# Altium schematic sheet Sheet1.SchDoc
size A3
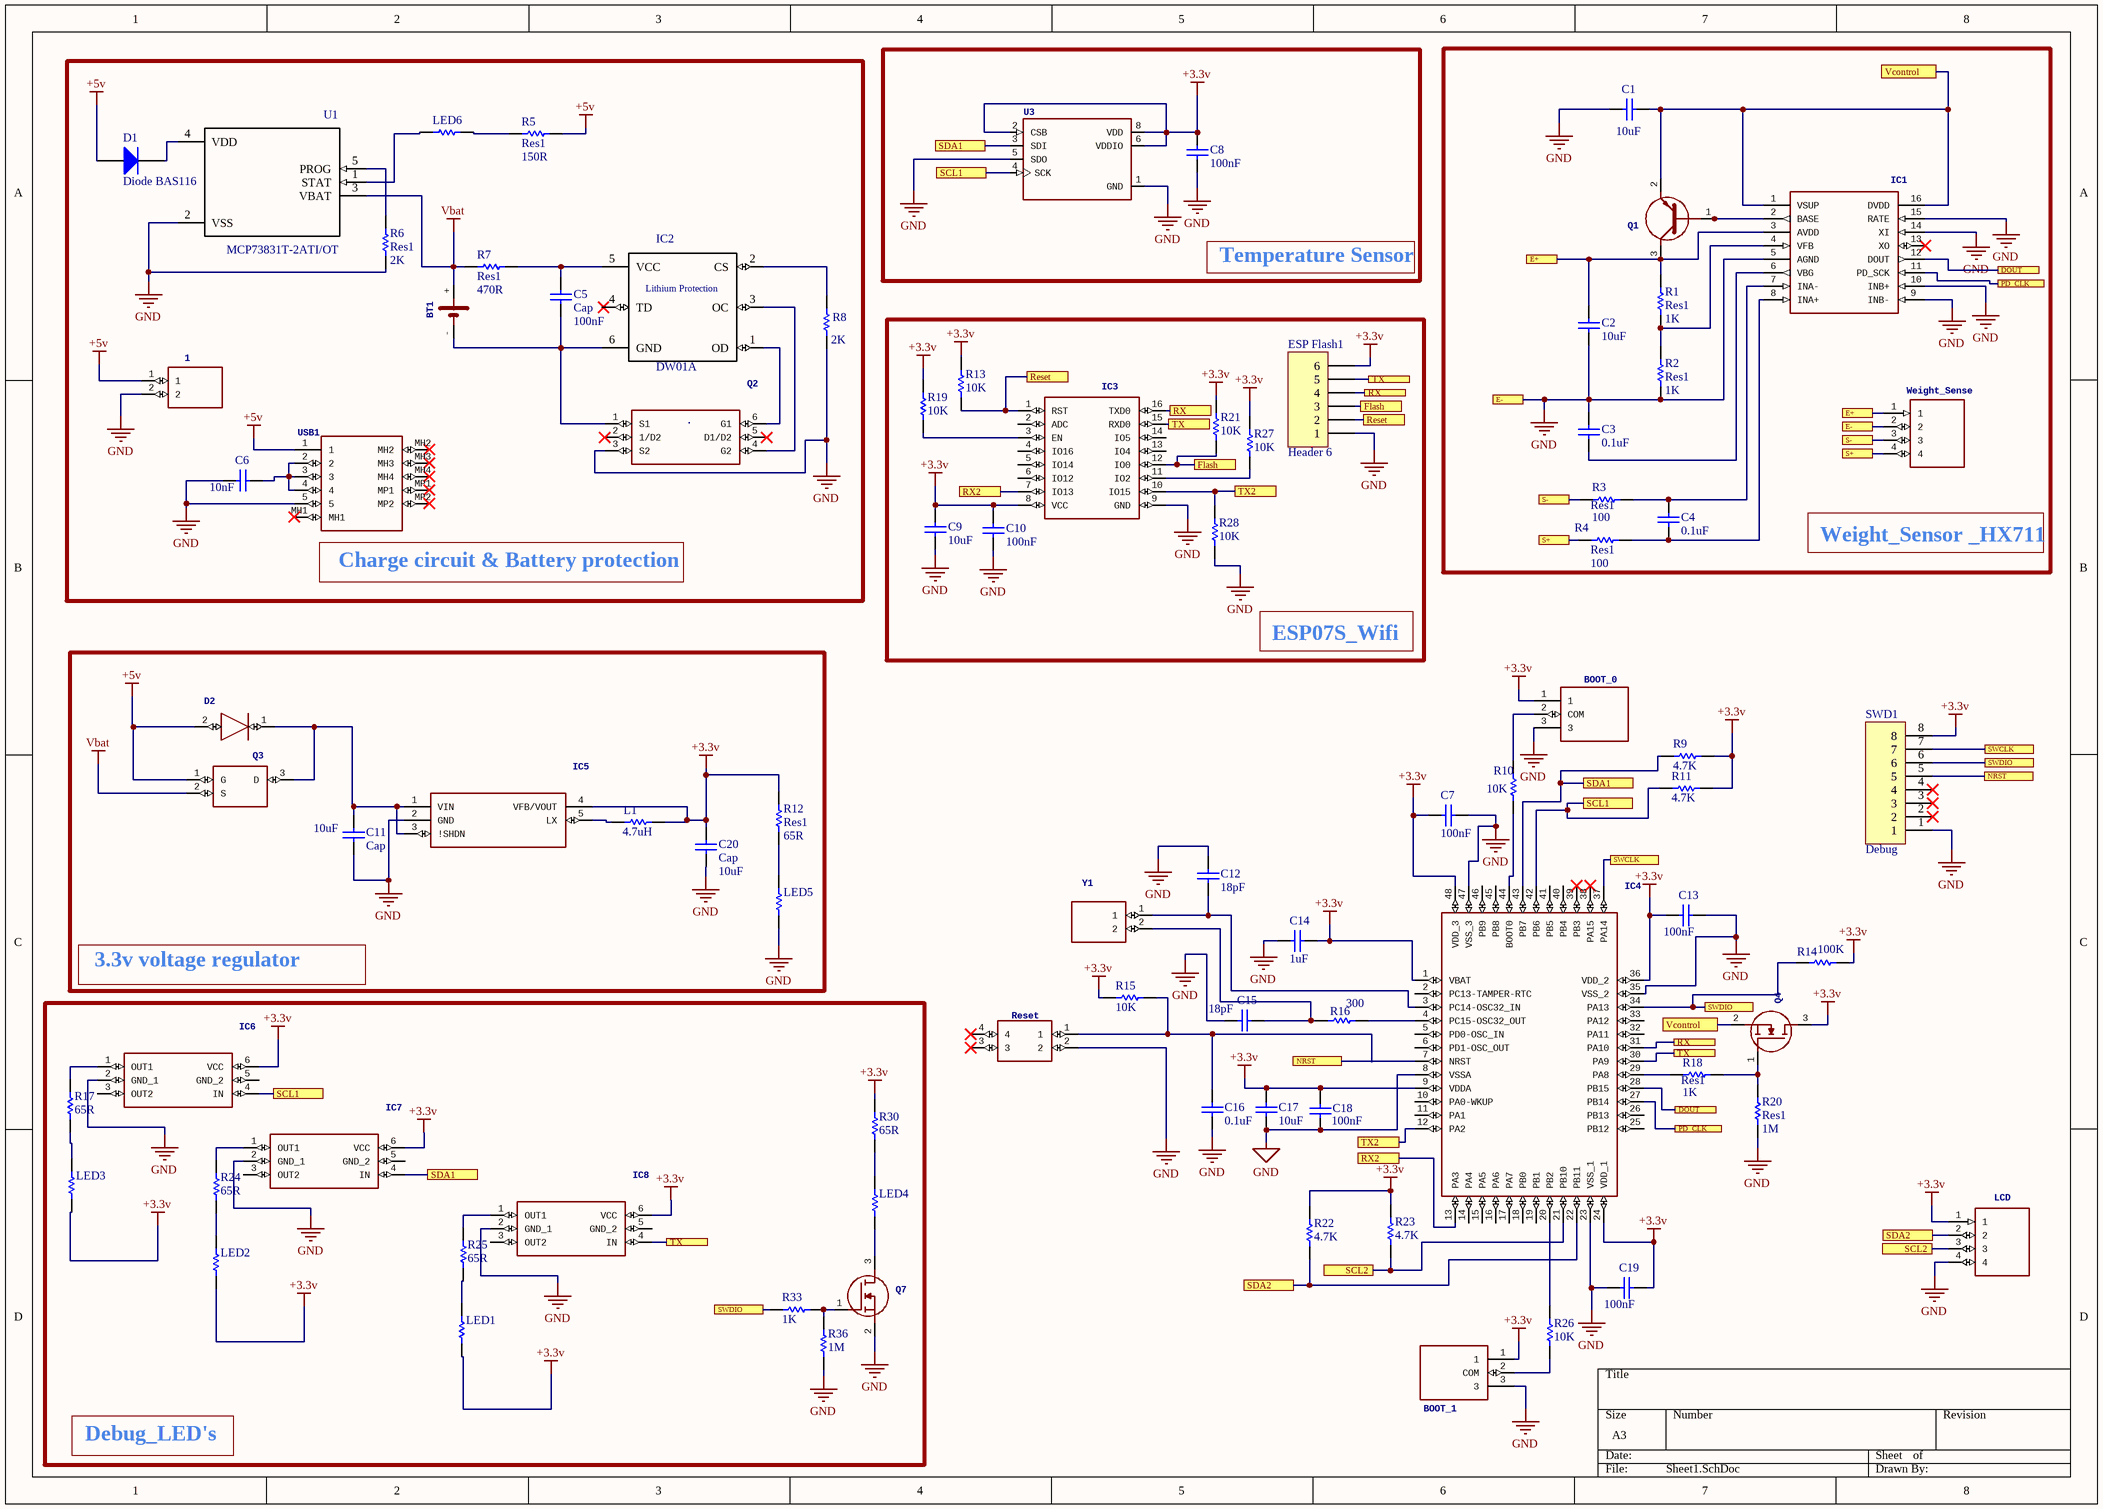
[diagram p0: Sheet1.SchDoc]

## Parts
1  P=3.81mm Screw terminal   Source:  Datasheet  [SHDR2W80P0X381_1X2_802X740X880]  (value not drawn)
BOOT_0  Slide Switch   Source:  Datasheet  [3PIN_SLIDE_SWITCH]  (value not drawn)
BOOT_1  Slide Switch   Source:  Datasheet  [3PIN_SLIDE_SWITCH]  (value not drawn)
BT1  Lithium-Ion Battery Holder, 1 Cell, Plastic UL 94V-O, SMT Check prices  [BAT_1042]  (value not drawn)
C1  value 10uF  [C1206]  (hidden comment: Cap Semi)
C2  value 10uF  [C1206]  (hidden comment: Cap Semi)
C3  value 0.1uF  [C1206]  (hidden comment: Cap Semi)
C4  value 0.1uF  [C1206]  (hidden comment: Cap Semi)
C5  Cap  value 100nF  [C1206]
C6  value 10nF  [C1206]
C7  value 100nF  [C1206]
C8  value 100nF  [C1206]
C9  value 10uF  [C1206]
C10  value 100nF  [C1206]
C11  Cap  value 10uF  [C1206]
C12  value 18pF  [C1206]
C13  value 100nF  [C1206]
C14  value 1uF  [C1206]
C15  value 18pF  [C1206]
C16  value 0.1uF  [C1206]
C17  value 10uF  [C1206]
C18  value 100nF  [C1206]
C19  value 100nF  [C1206]
C20  Cap  value 10uF  [C1206]
D1  Diode BAS116  [SOT-23_N]
D2  Diode, NXP, PMEG3010ER NXP PMEG3010ER, SMT Schottky Diode, 30V 1A, 2-Pin SOD-123   Source:  Datasheet  [SODFL3517X110N]  (value not drawn)
ESP_Flash1  Header 6  [HDR1X6]
IC1  24-Bit Analog-to-Digital Converter (ADC) for Weigh Scales   Source:  Datasheet  [SOIC127P600X160-16N]  (value not drawn)
IC2  DW01A  [*SOT23-6]
IC3  RF SOLUTIONS - ESP-12S - WIFI MODULE, 2.484GHZ, 9 I/O PORT   Source:  Datasheet  [ESP12S]  (value not drawn)
IC4  STM32F103C8T6, 32 bit ARM Cortex M3 Microcontroller 72MHz 64kb Flash, 20kb RAM, USB I2C SPI 48-Pin LQFP   Source:  Datasheet  [QFP50P900X900X160-48N]  (value not drawn)
IC5  Sw. Reg. PWM/PFM 2MHz 500mA 3.3V TSOT5   Source:  Datasheet  [SOT95P280X110-5N]  (value not drawn)
IC6  MAXIM INTEGRATED PRODUCTS - MAX2472EUT+T - VIDEO BUFFER AMP, SOT-23-6   Source:  Datasheet  [SOT95P280X145-6N]  (value not drawn)
IC7  MAXIM INTEGRATED PRODUCTS - MAX2472EUT+T - VIDEO BUFFER AMP, SOT-23-6   Source:  Datasheet  [SOT95P280X145-6N]  (value not drawn)
IC8  MAXIM INTEGRATED PRODUCTS - MAX2472EUT+T - VIDEO BUFFER AMP, SOT-23-6   Source:  Datasheet  [SOT95P280X145-6N]  (value not drawn)
L1  value 4.7uH  [C1206]
LCD  European P.C.B. type terminal blocks  EK series 4 pole   Source:  Datasheet  [SHDR4W90P0X381_1X4_1524X740X85]  (value not drawn)
LED1  (no value)  [C1206]
LED2  (no value)  [C1206]
LED3  (no value)  [C1206]
LED4  (no value)  [C1206]
LED5  (no value)  [C1206]
LED6  (no value)  [C1206]
Q1  Silicon Epitaxial Planar Transistor, PNP   Source:  Datasheet  [SOT95P240X110-3N]  (value not drawn)
Q2  Dual N-Channel Enhancement Mode MOSFET   Source:  Datasheet  [SOT95P285X140-6N]  (value not drawn)
Q3  INFINEON - IRLML6401TRPBF - MOSFET, P, MICRO3   Source:  Datasheet  [SOT95P237X112-3N]  (value not drawn)
Q4  360 mA, 60 V, N-CHANNEL, Si, SMALL SIGNAL, MOSFET, TO-236AB   Source:  Datasheet  [SOT95P230X110-3N]  (value not drawn)
Q7  360 mA, 60 V, N-CHANNEL, Si, SMALL SIGNAL, MOSFET, TO-236AB   Source:  Datasheet  [SOT95P230X110-3N]  (value not drawn)
R1  Res1  value 1K  [C1206]
R2  Res1  value 1K  [C1206]
R3  Res1  value 100  [C1206]
R4  Res1  value 100  [C1206]
R5  Res1  value 150R  [C1206]
R6  Res1  value 2K  [C1206]
R7  Res1  value 470R  [C1206]
R8  value 2K  [C1206]
R9  value 4.7K  [C1206]
R10  value 10K  [C1206]
R11  value 4.7K  [C1206]
R12  Res1  value 65R  [C1206]
R13  value 10K  [C1206]
R14  value 100K  [C1206]
R15  value 10K  [C1206]
R16  value 300  [C1206]
R17  value 65R  [C1206]
R18  Res1  value 1K  [C1206]
R19  value 10K  [C1206]
R20  Res1  value 1M  [C1206]
R21  value 10K  [C1206]
R22  value 4.7K  [C1206]
R23  value 4.7K  [C1206]
R24  value 65R  [C1206]
R25  value 65R  [C1206]
R26  value 10K  [C1206]
R27  value 10K  [C1206]
R28  value 10K  [C1206]
R30  value 65R  [C1206]
R33  value 1K  [C1206]
R36  value 1M  [C1206]
Reset  IP67 Button Tactile Switch, SPST 50 mA 3.5mm Surface Mount   Source:  Datasheet  [KSC401G50SHLFS]  (value not drawn)
SWD1  Debug  [HDR1X8]
U1  MCP73831T-2ATI/OT  [*SOT95P280X145-5N]
U3  BMP280 Absolute Barometric Pressure Sensor for Battery Powered Devices 2 x 2.5mm Check prices  [XDCR_BMP280]  (value not drawn)
USB1  USB Connectors 5P RoHS   Source:  Datasheet  [C40943]  (value not drawn)
Weight_Sense  European P.C.B. type terminal blocks  EK series 4 pole   Source:  Datasheet  [SHDR4W90P0X381_1X4_1524X740X85]  (value not drawn)
Y1  Automotive use crystal unit, 2-pin, NX5032GA   Source:  Datasheet  [NX5032GA]  (value not drawn)

## Blocks framed on the sheet
Charge circuit & Battery protection: 1 BT1 C5 C6 D1 IC2 LED6 Q2 R5-R8 U1 USB1
Temperature Sensor: C8 U3
Weight_Sensor _HX711: C1-C4 IC1 Q1 R1-R4 Weight_Sense
ESP07S_Wifi: C9 C10 ESP_Flash1 IC3 R13 R19 R21 R27 R28
3.3v voltage regulator: C11 C20 D2 IC5 L1 LED5 Q3 R12
Debug_LED's: IC6-IC8 LED1-LED4 Q7 R17 R24 R25 R30 R33 R36

## Ports
DOUT, E+, E-, Flash, NRST, PD_CLK, Reset, RX, RX2, S+, S-, SCL1, SCL2, SDA1, SDA2, SWCLK, SWDIO, TX, TX2, Vcontrol

## Nets
+3.3v: BOOT_0.1 BOOT_1.1 C7.1 C8.2 C9.2 C10.2 C13.1 C14.1 C17.1 C18.2 C19.2 C20.2 ESP_Flash1.6 IC3.8(VCC) IC4.1(VBAT) IC4.9(VDDA) IC4.24(VDD_1) IC4.36(VDD_2) IC4.48(VDD_3) IC5.4(VFB/VOUT) IC6.6(VCC) IC7.6(VCC) IC8.6(VCC) L1.1 LCD.1 LED1.2 LED2.2 LED3.2 Q4.3(D) R9.1 R11.1 R12.1 R13.1 R14.1 R15.2 R19.1 R21.1 R22.1 R23.1 R27.1 R30.1 SWD1.8 U3.2(CSB) U3.6(VDDIO) U3.8(VDD)
+5v: 1.1 D1.1(A) D2.2(A) Q3.1(G) R5.1 USB1.1
GND: 1.2 BOOT_0.3 BOOT_1.3 C1.1 C2.1 C3.2 C6.2 C7.2 C8.1 C9.1 C10.1 C11.1 C12.2 C13.2 C14.2 C15.1 C16.1 C17.2 C18.1 C19.1 C20.1 ESP_Flash1.1 IC1.5(AGND) IC1.9(INB-) IC1.10(INB+) IC1.14(XI) IC1.15(RATE) IC3.9(GND) IC4.8(VSSA) IC4.23(VSS_1) IC4.35(VSS_2) IC4.47(VSS_3) IC5.2(GND) IC6.2(GND_1) IC7.2(GND_1) IC8.2(GND_1) LCD.4 LED5.2 Q2.3(S2) Q7.2(S) R2.1 R6.1 R8.1 R20.2 R28.2 R36.2 Reset.2 SWD1.1 U1.2(VSS) U3.1(GND) U3.5(SDO) USB1.5 Weight_Sense.2 ; port E-
Vbat: BT1.+ Q3.2(S) R7.1 U1.3(VBAT)
DOUT: IC1.12(DOUT) IC4.28(PB15) ; port DOUT
E+: C2.2 IC1.3(AVDD) Q1.3(C) R1.2 Weight_Sense.1 ; port E+
Flash: ESP_Flash1.3 IC3.12(IO0) R21.2 ; port Flash
NRST: IC4.7(NRST) SWD1.5 ; port NRST
PD_CLK: IC1.11(PD_SCK) IC4.27(PB14) ; port PD_CLK
Reset: ESP_Flash1.2 IC3.1(RST) R13.2 ; port Reset
RX: ESP_Flash1.4 IC3.16(TXD0) IC4.31(PA10) ; port RX
RX2: IC3.7(IO13) IC4.13(PA3) ; port RX2
S+: R4.2 Weight_Sense.4 ; port S+
S-: R3.2 Weight_Sense.3 ; port S-
SCL1: IC4.42(PB6) IC6.4(IN) R11.2 U3.4(SCK) ; port SCL1
SCL2: IC4.21(PB10) LCD.3 R23.2 ; port SCL2
SDA1: IC4.43(PB7) IC7.4(IN) R9.2 U3.3(SDI) ; port SDA1
SDA2: IC4.22(PB11) LCD.2 R22.2 ; port SDA2
SWCLK: IC4.37(PA14) SWD1.7 ; port SWCLK
SWDIO: IC4.34(PA13) R14.2 R33.2 SWD1.6 ; port SWDIO
TX: ESP_Flash1.5 IC3.15(RXD0) IC4.30(PA9) IC8.4(IN) ; port TX
TX2: IC3.10(IO15) IC4.12(PA2) R28.1 ; port TX2
Vcontrol: C1.2 IC1.1(VSUP) IC1.16(DVDD) Q1.2(E) Q4.2(S) ; port Vcontrol
NetBOOT_0_2: BOOT_0.2(COM) R10.2
NetBOOT_1_2: BOOT_1.2(COM) R26.1
NetBT1_-: BT1.- C5.1 IC2.6(GND) Q2.1(S1)
NetC3_1: C3.1 IC1.6(VBG)
NetC4_1: C4.1 IC1.8(INA+) R4.1
NetC4_2: C4.2 IC1.7(INA-) R3.1
NetC5_2: C5.2 IC2.5(VCC) R7.2
NetC6_1: C6.1 USB1.2 USB1.3 USB1.4
NetC11_2: C11.2 D2.1(K) IC5.1(VIN) IC5.3(!SHDN) Q3.3(D)
NetC12_1: C12.1 IC4.3(PC14-OSC32_IN) Y1.1
NetC15_2: C15.2 R16.2 Y1.2
NetC16_2: C16.2 R15.1 Reset.1
NetD1_3: D1.3(K) U1.4(VDD)
NetIC1_2: IC1.2(BASE) Q1.1(B)
NetIC1_4: IC1.4(VFB) R1.1 R2.2
NetIC2_1: IC2.1(OD) Q2.6(G1)
NetIC2_2: IC2.2(CS) R8.2
NetIC2_3: IC2.3(OC) Q2.4(G2)
NetIC3_3: IC3.3(EN) R19.2
NetIC3_11: IC3.11(IO2) R27.2
NetIC4_4: IC4.4(PC15-OSC32_OUT) R16.1
NetIC4_20: IC4.20(PB2) R26.2
NetIC4_29: IC4.29(PA8) R18.2
NetIC4_44: IC4.44(BOOT0) R10.1
NetIC5_5: IC5.5(LX) L1.2
NetIC6_1: IC6.1(OUT1) R17.1
NetIC7_1: IC7.1(OUT1) R24.1
NetIC8_1: IC8.1(OUT1) R25.1
NetLED1_1: LED1.1 R25.2
NetLED2_1: LED2.1 R24.2
NetLED3_1: LED3.1 R17.2
NetLED4_1: LED4.1 R30.2
NetLED4_2: LED4.2 Q7.3(D)
NetLED5_1: LED5.1 R12.2
NetLED6_1: LED6.1 U1.1(STAT)
NetLED6_2: LED6.2 R5.2
NetQ4_1: Q4.1(G) R18.1 R20.1
NetQ7_1: Q7.1(G) R33.1 R36.1
NetR6_2: R6.2 U1.5(PROG)

Not connected (* = marked no-connect by the designer): IC1 13(XO)*; IC2 4(TD); IC3 2(ADC) 4(IO16) 5(IO14) 6(IO12) 13(IO4) 14(IO5); IC4 2(PC13-TAMPER-RTC) 5(PD0-OSC_IN) 6(PD1-OSC_OUT) 10(PA0-WKUP) 11(PA1) 14(PA4) 15(PA5) 16(PA6) 17(PA7) 18(PB0) 19(PB1) 25(PB12) 26(PB13) 32(PA11) 33(PA12) 38(PA15)* 39(PB3)* 40(PB4) 41(PB5) 45(PB8) 46(PB9); IC6 3(OUT2) 5(GND_2); IC7 3(OUT2) 5(GND_2); IC8 3(OUT2) 5(GND_2); Q2 2(1/D2)* 5(D1/D2)*; Reset 3* 4*; SWD1 2* 3* 4*; USB1 MH1* MH2* MH3* MH4* MP1* MP2*

## Notes on the sheet
- (in symbol DW01A) Lithium Protection

## Library data of the parts
1 = DB125-3.81-2P: Manufacturer_Name: Dibo; GateName_1: G$1; SymbolName_1: DB125-3.81-2P; LibraryName: DB125-3.81-2P; DeviceSetName: DB125-3.81-2P; Package: SHDR2W80P0X381_1X2_802X740X880; Manufacturer_Part_Number: DB125-3.81-2P; Height: 8.8mm
BOOT_0 BOOT_1 = EG1218: Manufacturer_Name: E-Switch; GateName_1: G$1; SymbolName_1: EG1218; LibraryName: EG1218; DeviceSetName: EG1218; Package: 3PIN_SLIDE_SWITCH; Manufacturer_Part_Number: EG1218; Mouser_Part_Number: 612-EG1218; Mouser_Price-Stock: https://www.mouser.co.uk/ProductDetail/E-Switch/EG1218?qs=xDsBkp9LkocT0c8K%252B5e%2FgA%3D%3D; Height: mm
BT1 = 1042: GateName_1: G$1; MF: Keystone Electronics Corp.; SymbolName_1: 1042; LibraryName: 1042; DeviceSetName: 1042; Package: BAT_1042; Purchase-URL: https://pricing.snapeda.com/search/part/1042/?ref=eda; MP: 1042; Package: None; Price: None; Availability: Good
C1-C4 = Cap Semi: Capacitor (Semiconductor SIM Model); Published: 8-Jun-2000; LatestRevisionDate: 29-May-2009; LatestRevisionNote: IPC-7351 Footprint Added.; PackageReference: C1206; Publisher: Altium Limited; PackageDescription: Chip Capacitor
C5-C20 = Cap: Capacitor; Published: 8-Jun-2000; LatestRevisionDate: 17-Jul-2002; LatestRevisionNote: Re-released for DXP Platform.; PackageReference: RAD-0.3; Publisher: Altium Limited; PackageDescription: Radial Cap, Thru-Hole; 2 Leads; 0.3 in Pin Spacing
D1 = Diode BAS116: Silicon Low Leakage Diode; Note: Pin 2 is not connected and not drawn.; Published: 21-Mar-2003; LatestRevisionDate: 29-May-2009; LatestRevisionNote: IPC-7351 Footprint Added.; DatasheetVersion: Oct-1999; PackageVersion: Sep-2001; PackageReference: SOT-23; Publisher: Altium Limited; PackageDescription: 3-Pin SOT-23 Package 0.95 mm Pitch, 2.5 mm Lead Span; ComponentLink1Description: Manufacturer Link; ComponentLink1URL: http://www.infineon.com/; ComponentLink2Description: Datasheet; ComponentLink2URL: http://www.infineon.com/upload/Document/cmc_upload/documents/080/656/bas116series.pdf
D2 = PMEG3010ER: Manufacturer_Name: Nexperia; GateName_1: G$1; SymbolName_1: PMEG3010ER; LibraryName: PMEG3010ER; DeviceSetName: PMEG3010ER; Package: SODFL3517X110N; Manufacturer_Part_Number: PMEG3010ER; Mouser_Part_Number: N/A; Mouser_Price-Stock: https://www.mouser.com/Search/Refine.aspx?Keyword=N%2FA; Height: 1.1mm
ESP_Flash1 = Header 6: Header, 6-Pin; LatestRevisionDate: 17-Jul-2002; LatestRevisionNote: Re-released for DXP Platform.; Publisher: Altium Limited
IC1 = HX711: Manufacturer_Name: DFRobot; GateName_1: G$1; SymbolName_1: HX711; LibraryName: HX711; DeviceSetName: HX711; Package: SOIC127P600X160-16N; Manufacturer_Part_Number: HX711; Height: 1.6mm
IC2 = DW01A: One Cell Lithium-ion/Polymer Battery Protection IC; MF: Fortune Semiconductor; Price: None; MP: DW01A; SnapEDA_Link: https://www.snapeda.com/parts/DW01A/Fortune%20Semiconductor/view-part/4388554/?ref=snap; Availability: Unavailable; Package: Package Analog Devices; Value: *
IC3 = ESP-12S: GateName_1: G$1; SymbolName_1: ESP-12S; LibraryName: ESP-12S; DeviceSetName: ESP-12S; Package: ESP12S; Manufacturer_Name: RF SOLUTIONS; Manufacturer_Part_Number: ESP-12S; Mouser_Part_Number: 223-ESP-12S; Mouser_Price-Stock: https://www.mouser.co.uk/ProductDetail/RF-Solutions/ESP-12S?qs=UkDUCjYnTB27YArJ5wHUxg%3D%3D; RS_Part_Number: 1697593; RS_Price-Stock: http://uk.rs-online.com/web/p/products/1697593; Height: 3mm
IC4 = STM32F103C8T6: Manufacturer_Name: STMicroelectronics; GateName_1: G$1; SymbolName_1: STM32F103C8T6; LibraryName: STM32F103C8T6; DeviceSetName: STM32F103C8T6; Package: QFP50P900X900X160-48N; Manufacturer_Part_Number: STM32F103C8T6; Arrow_Part_Number: STM32F103C8T6; Arrow_Price-Stock: https://www.arrow.com/en/products/stm32f103c8t6/stmicroelectronics; Mouser_Part_Number: 511-STM32F103C8T6; Mouser_Price-Stock: https://www.mouser.co.uk/ProductDetail/STMicroelectronics/STM32F103C8T6?qs=bhCVus9SdFtq6kqxsU5%2FDA%3D%3D; Height: 1.6mm
IC5 = MCP1603T-330I_OS: Manufacturer_Name: Microchip; Manufacturer_Part_Number: MCP1603T-330I/OS; GateName_1: G$1; Allied_Number: 70046434; SymbolName_1: MCP1603T-330I_OS; LibraryName: MCP1603T-330I_OS; DeviceSetName: MCP1603T-330I_OS; Package: SOT95P280X110-5N; Mouser_Part_Number: 579-MCP1603T-330I/OS; Mouser_Price-Stock: https://www.mouser.co.uk/ProductDetail/Microchip-Technology/MCP1603T-330I-OS?qs=usxtMOJb1RzTHtIF7bKmHg%3D%3D; RS_Part_Number: 7386235P; RS_Price-Stock: http://uk.rs-online.com/web/p/products/7386235P; Allied_Price-Stock: http://www.alliedelec.com/microchip-technology-inc-mcp1603t-330i-os/70046434/; Height: 1.1mm
IC6-IC8 = MAX2472EUT+T: GateName_1: G$1; SymbolName_1: MAX2472EUT+T; LibraryName: MAX2472EUT+T; DeviceSetName: MAX2472EUT+T; Package: SOT95P280X145-6N; Manufacturer_Name: Maxim Integrated; Manufacturer_Part_Number: MAX2472EUT+T; Mouser_Part_Number: 700-MAX2472EUTT; Mouser_Price-Stock: https://www.mouser.com/Search/Refine.aspx?Keyword=700-MAX2472EUTT; Height: 1.45mm
L1 LED1-LED6 R1-R28 R30 R33 R36 = Res1: Resistor; Published: 8-Jun-2000; LatestRevisionDate: 17-Jul-2002; LatestRevisionNote: Re-released for DXP Platform.; PackageReference: AXIAL-0.3; Publisher: Altium Limited; PackageDescription: Axial Device, Thru-Hole; 2 Leads; 0.3 in Pin Spacing
LCD Weight_Sense = EK381V-04P: Manufacturer_Name: Dinkle; GateName_1: G$1; SymbolName_1: EK381V-04P; LibraryName: EK381V-04P; DeviceSetName: EK381V-04P; Package: SHDR4W90P0X381_1X4_1524X740X85; Manufacturer_Part_Number: EK381V-04P; Height: 8.5mm
Q1 = S8550: Manufacturer_Name: Galaxy; GateName_1: G$1; SymbolName_1: S8550; LibraryName: S8550; DeviceSetName: S8550; Package: SOT95P240X110-3N; Manufacturer_Part_Number: S8550; Height: 1.1mm
Q2 = UMW8205A: Manufacturer_Name: UMW; GateName_1: G$1; SymbolName_1: UMW8205A; LibraryName: UMW8205A; DeviceSetName: UMW8205A; Package: SOT95P285X140-6N; Manufacturer_Part_Number: UMW8205A; Height: 1.4mm
Q3 = IRLML6401TRPBF: GateName_1: G$1; Allied_Number: 70017403; SymbolName_1: IRLML6401TRPBF; LibraryName: IRLML6401TRPBF; DeviceSetName: IRLML6401TRPBF; Package: SOT95P237X112-3N; Manufacturer_Name: Infineon; Manufacturer_Part_Number: IRLML6401TRPBF; Mouser_Part_Number: 942-IRLML6401TRPBF; Mouser_Price-Stock: https://www.mouser.co.uk/ProductDetail/Infineon-Technologies/IRLML6401TRPBF?qs=9%252BKlkBgLFf1wviSVMCNr8A%3D%3D; RS_Part_Number: 0301316P; RS_Price-Stock: http://uk.rs-online.com/web/p/products/0301316P; Allied_Price-Stock: https://www.alliedelec.com/infineon-irlml6401trpbf/70017403/; Height: 1.12mm
Q4 Q7 = BSS138BK: Manufacturer_Name: NXP; GateName_1: G$1; SymbolName_1: BSS138BK; LibraryName: BSS138BK; DeviceSetName: BSS138BK; Package: SOT95P230X110-3N; Manufacturer_Part_Number: BSS138BK; Mouser_Part_Number: N/A; Mouser_Price-Stock: https://www.mouser.co.uk/ProductDetail/NXP-Semiconductors/BSS138BK?qs=55YtniHzbhD7oyuUiV2leA%3D%3D; Height: 1.1mm
Reset = KSC222GLFS: Manufacturer_Name: C & K COMPONENTS; GateName_1: G$1; SymbolName_1: KSC222GLFS; LibraryName: KSC222GLFS; DeviceSetName: KSC222GLFS; Package: KSC401G50SHLFS; Manufacturer_Part_Number: KSC222GLFS; Mouser_Part_Number: 611-KSC222GLFS; Mouser_Price-Stock: https://www.mouser.co.uk/ProductDetail/CK/KSC222GLFS?qs=8LLMQjkBYsIt%2F%2FXoP9fBVA%3D%3D; RS_Part_Number: 8998582; RS_Price-Stock: http://uk.rs-online.com/web/p/products/8998582; Height: mm
SWD1 = Header 8: Header, 8-Pin; LatestRevisionDate: 17-Jul-2002; LatestRevisionNote: Re-released for DXP Platform.; Publisher: Altium Limited
U1 = MCP73831T-2ATI/OT: MCP73831 Series Li-Ion/Li-Pol 15 mA - 500 mA 4.2 V Charge Controller - SOT-23-5; MF: Microchip; Price: None; MP: MCP73831T-2ATI/OT; SnapEDA_Link: https://www.snapeda.com/parts/MCP73831T-2ATI/OT/Microchip/view-part/51423/?ref=snap; Availability: Unavailable; Package: SOT-23 Microchip; Value: *
U3 = BMP280: GateName_1: G$1; MF: Bosch; SymbolName_1: BMP280; LibraryName: BMP280; DeviceSetName: BMP280; Package: XDCR_BMP280; Price: None; Purchase-URL: https://pricing.snapeda.com/search/part/BMP280/?ref=eda; Package: SMD-8 Bosch Sensortec; MP: BMP280; Availability: Warning
USB1 = C40943: Manufacturer_Name: Jing Extension of the Electronic Co.; GateName_1: G$1; SymbolName_1: C40943; LibraryName: C40943; DeviceSetName: C40943; Package: C40943; Manufacturer_Part_Number: C40943; Height: 2.61mm
Y1 = NX5032GA-8.000M-STD-CSU-1: Manufacturer_Name: NDK; GateName_1: G$1; SymbolName_1: NX5032GA-8.000M-STD-CSU-1; LibraryName: NX5032GA-8.000M-STD-CSU-1; DeviceSetName: NX5032GA-8.000M-STD-CSU-1; Package: NX5032GA; Manufacturer_Part_Number: NX5032GA-8.000M-STD-CSU-1; Mouser_Part_Number: 344-NX5032GA8MCSU1; Mouser_Price-Stock: https://www.mouser.co.uk/ProductDetail/NDK/NX5032GA-8000M-STD-CSU-1?qs=55YtniHzbhDXxgRf1t%252Bj4Q%3D%3D; RS_Part_Number: 1847981; RS_Price-Stock: http://uk.rs-online.com/web/p/products/1847981; Height: mm